# Altium schematic sheet ADC-Z-DOK.SchDoc: <SPECIFIC SHEET FUNCTION>
size A3; Date: DO NOT USE, RATHER USE PROJ OPTIONS; DrawnBy: DO NOT USE, RATHER USE PROJ OPTIONS; Engineer: DO NOT USE, RATHER USE PROJ OPTIONS; Organization: DO NOT USE, RATHER USE PROJ OPTIONS; DocumentNumber: 6; Revision: DO NOT USE, RATHER USE PROJ OPTIONS; SheetNumber: 6; SheetTotal: 12; SCH_Sheet_Filename: ADC-Z-DOK.SchDoc; CurrentTime: DO NOT USE, RATHER USE PROJ OPTIONS; Time: DO NOT USE, RATHER USE PROJ OPTIONS; DocumentFullPathAndName: DO NOT USE, RATHER USE PROJ OPTIONS; DocumentName: DO NOT USE, RATHER USE PROJ OPTIONS; ModifiedDate: DO NOT USE, RATHER USE PROJ OPTIONS; ImagePath: DO NOT USE, RATHER USE PROJ OPTIONS
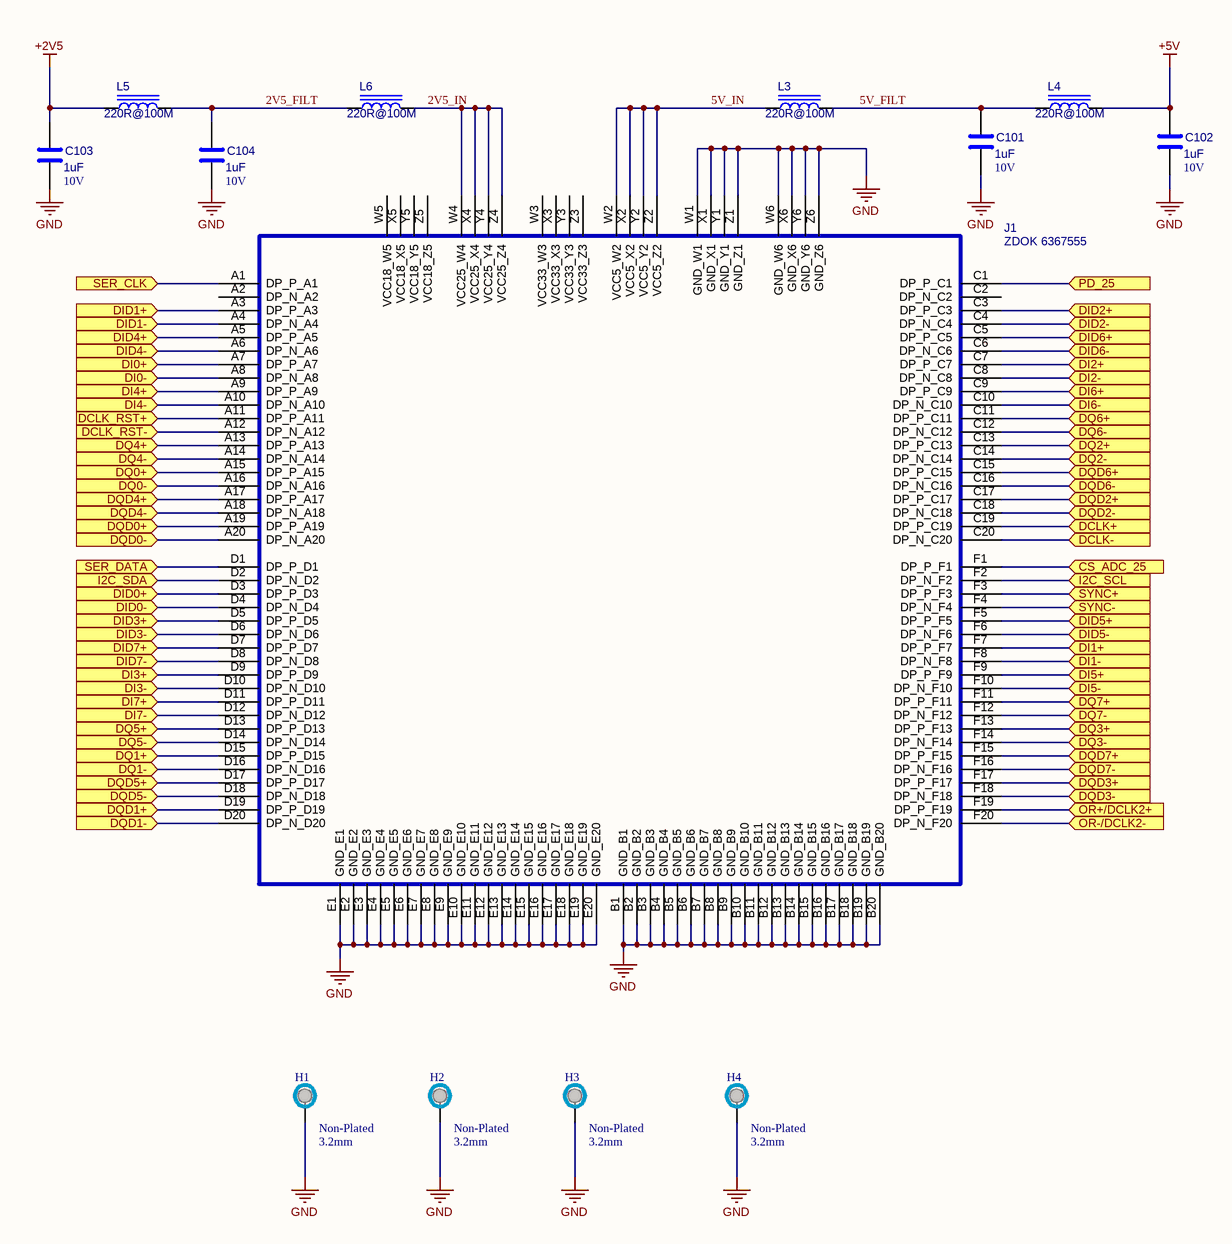
[diagram p0: ADC-Z-DOK.SchDoc]

## Parts
C101  value 1uF  Voltage: 10V  [CAPC1632X80USR]  (hidden comment: *)
C102  value 1uF  Voltage: 10V  [CAPC1632X80USR]  (hidden comment: *)
C103  value 1uF  Voltage: 10V  [CAPC1632X80USR]  (hidden comment: *)
C104  value 1uF  Voltage: 10V  [CAPC1632X80USR]  (hidden comment: *)
H1  Non-Plated  HoleDia: 3.2mm  [HOLE]  (no BOM)
H2  Non-Plated  HoleDia: 3.2mm  [HOLE]  (no BOM)
H3  Non-Plated  HoleDia: 3.2mm  [HOLE]  (no BOM)
H4  Non-Plated  HoleDia: 3.2mm  [HOLE]  (no BOM)
J1  Z-DOK  [TYCO6367555]  (value not drawn)
L3  Voltage: 220R@100M  [INDC1608X80USR]  (hidden comment: TDK)
L4  Voltage: 220R@100M  [INDC1608X80USR]  (hidden comment: TDK)
L5  Voltage: 220R@100M  [INDC1608X80USR]  (hidden comment: TDK)
L6  Voltage: 220R@100M  [INDC1608X80USR]  (hidden comment: TDK)

## Ports
CS_ADC_25 (in), DCLK+ (in), DCLK- (in), DCLK_RST+ (in), DCLK_RST- (in), DI0+ (in), DI0- (in), DI1+ (in), DI1- (in), DI2+ (in), DI2- (in), DI3+ (in), DI3- (in), DI4+ (in), DI4- (in), DI5+ (in), DI5- (in), DI6+ (in), DI6- (in), DI7+ (in), DI7- (in), DID0+ (in), DID0- (in), DID1+ (in), DID1- (in), DID2+ (in), DID2- (in), DID3+ (in), DID3- (in), DID4+ (in), DID4- (in), DID5+ (in), DID5- (in), DID6+ (in), DID6- (in), DID7+ (in), DID7- (in), DQ0+ (in), DQ0- (in), DQ1+ (in), DQ1- (in), DQ2+ (in), DQ2- (in), DQ3+ (in), DQ3- (in), DQ4+ (in), DQ4- (in), DQ5+ (in), DQ5- (in), DQ6+ (in), DQ6- (in), DQ7+ (in), DQ7- (in), DQD0+ (in), DQD0- (in), DQD1+ (in), DQD1- (in), DQD2+ (in), DQD2- (in), DQD3+ (in), DQD3- (in), DQD4+ (in), DQD4- (in), DQD5+ (in), DQD5- (in), DQD6+ (in), DQD6- (in), DQD7+ (in), DQD7- (in), I2C_SCL (in), I2C_SDA (in), OR+/DCLK2+ (in), OR-/DCLK2- (in), PD_25 (in), SER_CLK (in), SER_DATA (in), SYNC+ (in), SYNC- (in)

## Nets
+2V5: C103.1 L5.1
+5V: C102.1 L4.2
GND: C101.2 C102.2 C103.2 C104.2 H1.1(TP) H2.1(TP) H3.1(TP) H4.1(TP) J1.B1(GND_B1) J1.B2(GND_B2) J1.B3(GND_B3) J1.B4(GND_B4) J1.B5(GND_B5) J1.B6(GND_B6) J1.B7(GND_B7) J1.B8(GND_B8) J1.B9(GND_B9) J1.B10(GND_B10) J1.B11(GND_B11) J1.B12(GND_B12) J1.B13(GND_B13) J1.B14(GND_B14) J1.B15(GND_B15) J1.B16(GND_B16) J1.B17(GND_B17) J1.B18(GND_B18) J1.B19(GND_B19) J1.B20(GND_B20) J1.E1(GND_E1) J1.E2(GND_E2) J1.E3(GND_E3) J1.E4(GND_E4) J1.E5(GND_E5) J1.E6(GND_E6) J1.E7(GND_E7) J1.E8(GND_E8) J1.E9(GND_E9) J1.E10(GND_E10) J1.E11(GND_E11) J1.E12(GND_E12) J1.E13(GND_E13) J1.E14(GND_E14) J1.E15(GND_E15) J1.E16(GND_E16) J1.E17(GND_E17) J1.E18(GND_E18) J1.E19(GND_E19) J1.E20(GND_E20) J1.W1(GND_W1) J1.W6(GND_W6) J1.X1(GND_X1) J1.X6(GND_X6) J1.Y1(GND_Y1) J1.Y6(GND_Y6) J1.Z1(GND_Z1) J1.Z6(GND_Z6)
2V5_FILT: C104.1 L5.2 L6.1
2V5_IN: J1.W4(VCC25_W4) J1.X4(VCC25_X4) J1.Y4(VCC25_Y4) J1.Z4(VCC25_Z4) L6.2
5V_FILT: C101.1 L3.2 L4.1
5V_IN: J1.W2(VCC5_W2) J1.X2(VCC5_X2) J1.Y2(VCC5_Y2) J1.Z2(VCC5_Z2) L3.1
CS_ADC_25: J1.F1(DP_P_F1) ; port CS_ADC_25
DCLK+: J1.C19(DP_P_C19) ; port DCLK+
DCLK-: J1.C20(DP_N_C20) ; port DCLK-
DCLK_RST+: J1.A11(DP_P_A11) ; port DCLK_RST+
DCLK_RST-: J1.A12(DP_N_A12) ; port DCLK_RST-
DI0+: J1.A7(DP_P_A7) ; port DI0+
DI0-: J1.A8(DP_N_A8) ; port DI0-
DI1+: J1.F7(DP_P_F7) ; port DI1+
DI1-: J1.F8(DP_N_F8) ; port DI1-
DI2+: J1.C7(DP_P_C7) ; port DI2+
DI2-: J1.C8(DP_N_C8) ; port DI2-
DI3+: J1.D9(DP_P_D9) ; port DI3+
DI3-: J1.D10(DP_N_D10) ; port DI3-
DI4+: J1.A9(DP_P_A9) ; port DI4+
DI4-: J1.A10(DP_N_A10) ; port DI4-
DI5+: J1.F9(DP_P_F9) ; port DI5+
DI5-: J1.F10(DP_N_F10) ; port DI5-
DI6+: J1.C9(DP_P_C9) ; port DI6+
DI6-: J1.C10(DP_N_C10) ; port DI6-
DI7+: J1.D11(DP_P_D11) ; port DI7+
DI7-: J1.D12(DP_N_D12) ; port DI7-
DID0+: J1.D3(DP_P_D3) ; port DID0+
DID0-: J1.D4(DP_N_D4) ; port DID0-
DID1+: J1.A3(DP_P_A3) ; port DID1+
DID1-: J1.A4(DP_N_A4) ; port DID1-
DID2+: J1.C3(DP_P_C3) ; port DID2+
DID2-: J1.C4(DP_N_C4) ; port DID2-
DID3+: J1.D5(DP_P_D5) ; port DID3+
DID3-: J1.D6(DP_N_D6) ; port DID3-
DID4+: J1.A5(DP_P_A5) ; port DID4+
DID4-: J1.A6(DP_N_A6) ; port DID4-
DID5+: J1.F5(DP_P_F5) ; port DID5+
DID5-: J1.F6(DP_N_F6) ; port DID5-
DID6+: J1.C5(DP_P_C5) ; port DID6+
DID6-: J1.C6(DP_N_C6) ; port DID6-
DID7+: J1.D7(DP_P_D7) ; port DID7+
DID7-: J1.D8(DP_N_D8) ; port DID7-
DQ0+: J1.A15(DP_P_A15) ; port DQ0+
DQ0-: J1.A16(DP_N_A16) ; port DQ0-
DQ1+: J1.D15(DP_P_D15) ; port DQ1+
DQ1-: J1.D16(DP_N_D16) ; port DQ1-
DQ2+: J1.C13(DP_P_C13) ; port DQ2+
DQ2-: J1.C14(DP_N_C14) ; port DQ2-
DQ3+: J1.F13(DP_P_F13) ; port DQ3+
DQ3-: J1.F14(DP_N_F14) ; port DQ3-
DQ4+: J1.A13(DP_P_A13) ; port DQ4+
DQ4-: J1.A14(DP_N_A14) ; port DQ4-
DQ5+: J1.D13(DP_P_D13) ; port DQ5+
DQ5-: J1.D14(DP_N_D14) ; port DQ5-
DQ6+: J1.C11(DP_P_C11) ; port DQ6+
DQ6-: J1.C12(DP_N_C12) ; port DQ6-
DQ7+: J1.F11(DP_P_F11) ; port DQ7+
DQ7-: J1.F12(DP_N_F12) ; port DQ7-
DQD0+: J1.A19(DP_P_A19) ; port DQD0+
DQD0-: J1.A20(DP_N_A20) ; port DQD0-
DQD1+: J1.D19(DP_P_D19) ; port DQD1+
DQD1-: J1.D20(DP_N_D20) ; port DQD1-
DQD2+: J1.C17(DP_P_C17) ; port DQD2+
DQD2-: J1.C18(DP_N_C18) ; port DQD2-
DQD3+: J1.F17(DP_P_F17) ; port DQD3+
DQD3-: J1.F18(DP_N_F18) ; port DQD3-
DQD4+: J1.A17(DP_P_A17) ; port DQD4+
DQD4-: J1.A18(DP_N_A18) ; port DQD4-
DQD5+: J1.D17(DP_P_D17) ; port DQD5+
DQD5-: J1.D18(DP_N_D18) ; port DQD5-
DQD6+: J1.C15(DP_P_C15) ; port DQD6+
DQD6-: J1.C16(DP_N_C16) ; port DQD6-
DQD7+: J1.F15(DP_P_F15) ; port DQD7+
DQD7-: J1.F16(DP_N_F16) ; port DQD7-
I2C_SCL: J1.F2(DP_N_F2) ; port I2C_SCL
I2C_SDA: J1.D2(DP_N_D2) ; port I2C_SDA
OR+/DCLK2+: J1.F19(DP_P_F19) ; port OR+/DCLK2+
OR-/DCLK2-: J1.F20(DP_N_F20) ; port OR-/DCLK2-
PD_25: J1.C1(DP_P_C1) ; port PD_25
SER_CLK: J1.A1(DP_P_A1) ; port SER_CLK
SER_DATA: J1.D1(DP_P_D1) ; port SER_DATA
SYNC+: J1.F3(DP_P_F3) ; port SYNC+
SYNC-: J1.F4(DP_N_F4) ; port SYNC-

Not connected (* = marked no-connect by the designer): J1 A2(DP_N_A2) C2(DP_N_C2) W3(VCC33_W3) W5(VCC18_W5) X3(VCC33_X3) X5(VCC18_X5) Y3(VCC33_Y3) Y5(VCC18_Y5) Z3(VCC33_Z3) Z5(VCC18_Z5)

## Notes on the sheet
- 2009   THIS DOCUMENT IS THE PROPERTY OF THE OWNER, AND MAY NOT BE COPIED OR USED FOR ANY PURPOSE OTHER THAN THAT FOR WHICH IT IS SUPPLIED WITHOUT PERMISSION IN WRITING FROM THE OWNER.
- C
- DATESTAMP OF THIS PRINT
- DRAWN BY:
- DOCUMENT NUMBER:
- SCHEMATIC FILENAME:
- PCB FILENAME:
- ENGINEER:
- APPROVED:
- CIRCUIT DIAGRAM
- DATE
- SHEET
- REVISION
- OF

## Library data of the parts
C101-C104 = CAP-0603: CAP SMD 0603; Manufacturer: *; Manufacturer_PN: *; Created_By: *; Checked_By: *; Checked_Date: *; HelpURL: *; ComponentLink1Description: Footprint Detail; ComponentLink1URL: *; ComponentLink2Description: Application Note; ComponentLink2URL: *; ComponentLink3Description: Layout Guidelines; ComponentLink3URL: *; ComponentLink4Description: Technology Reference; ComponentLink4URL: *; Supplier1: *; Supplier2: *; Unit_Cost: *; MOQ: *; Leadtime: *; Inventory_Stock: *; Tolerance: *; Wattage: *; Package: 0603; ComponentLink5Description: Production Detail; ComponentLink5URL: *; Note: *; Stock Code: *
H1-H4 = Unplated Hole_3.2mm: PCB Mounting Hole; Category: Mounting Hole
J1 = ZDOK 6367555: Created_By: CT; Manufacturer: Z-DOK; Checked_By: *; Checked_Date: *; HelpURL: ENG_CS_1773095_Backplane_Connectors_Z-DOK_1208.pdf; ComponentLink1Description: Footprint Detail; ComponentLink1URL: ENG_CS_1773095_Backplane_Connectors_Z-DOK_1208.pdf#page=4; ComponentLink2Description: Application Note; ComponentLink2URL: *; ComponentLink3Description: Layout Guidelines; ComponentLink3URL: *; ComponentLink4Description: Technology Reference; ComponentLink4URL: *; Supplier1: *; Supplier2: *; Unit_Cost: *; MOQ: *; Leadtime: *; Inventory_Stock: *; Tolerance: *; Wattage: *; Package: *; ComponentLink5Description: Production Detail; ComponentLink5URL: *; Note: *; Stock Code: *; Manufacturer_PN: ZDOK 6367555
L3-L6 = MPZ16085221A: POWER LINE; Manufacturer: TDK; Created_By: *; Checked_By: *; Checked_Date: *; HelpURL: *; ComponentLink1Description: Footprint Detail; ComponentLink1URL: *; ComponentLink2Description: Application Note; ComponentLink2URL: *; ComponentLink3Description: Layout Guidelines; ComponentLink3URL: *; ComponentLink4Description: Technology Reference; ComponentLink4URL: *; Supplier1: *; Supplier2: *; Unit_Cost: *; MOQ: *; Leadtime: *; Inventory_Stock: *; Tolerance: *; Wattage: *; Package: *; ComponentLink5Description: Production Detail; ComponentLink5URL: *; Note: *; Stock Code: *; Manufacturer_PN: MPZ16085221A